# Altium schematic sheet OLED_MODEL.SchDoc
size A4
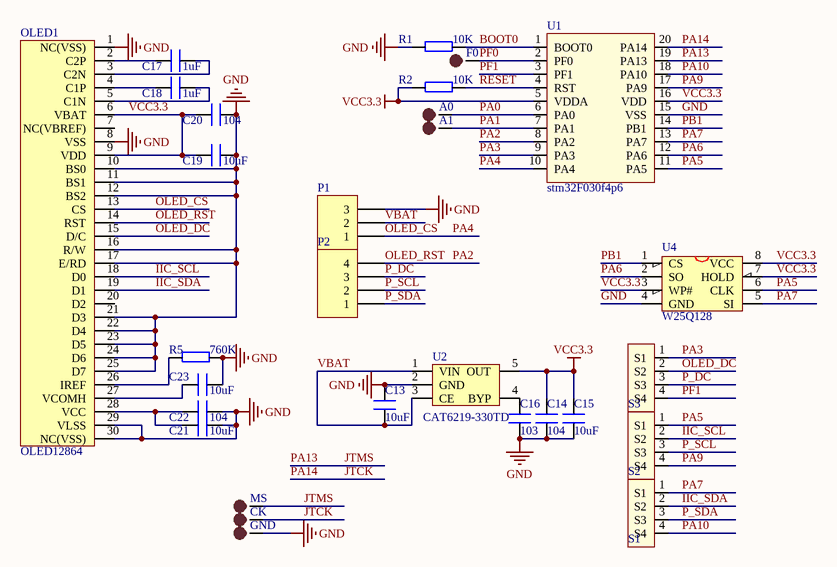
[diagram p0: OLED_MODEL.SchDoc]

## Parts
A0  TEST POINT  [TP-1.5]  (value not drawn)
A1  TEST POINT  [TP-1.5]  (value not drawn)
C13  10uF  [C 0603_L]
C14  104  [C 0603_L]
C15  10uF  [C 0603_L]
C16  103  [C 0603_L]
C17  1uF  [C 0603_L]
C18  1uF  [C 0603_L]
C19  10uF  [C 0603_L]
C20  104  [C 0603_L]
C21  10uF  [C 0603_L]
C22  104  [C 0603_L]
C23  10uF  [C 0603_L]
CK  TEST POINT  [TP-1.5]  (value not drawn)
F0  TEST POINT  [TP-1.5]  (value not drawn)
GND  TEST POINT  [TP-1.5]  (value not drawn)
MS  TEST POINT  [TP-1.5]  (value not drawn)
OLED1  OLED12864  [OLED_0.96]
P1  Header 3  [HDR2.54-LI-3P]  (value not drawn)
P2  Header 4  [HDR2.54-LI-4P]  (value not drawn)
R1  10K  [R 0603_L]
R2  10K  [R 0603_L]
R5  760K  [R 0603_L]
S1  selecter  [selector_4]  (value not drawn)
S2  selecter  [selector_4]  (value not drawn)
S3  selecter  [selector_4]  (value not drawn)
U1  stm32F030f4p6  [TSSOP20_N]
U2  CAT6219-330TD  [SOT23-5N]
U4  W25Q128  [SOIC-8]

## Nets
GND: C13.2 C14.1 C15.1 C16.1 C19.1 C20.1 C21.1 C22.1 C23.1 GND.1 OLED1.1(NC(VSS)) OLED1.8(VSS) OLED1.10(BS0) OLED1.11(BS1) OLED1.12(BS2) OLED1.16(R/W) OLED1.17(E/RD) OLED1.21(D3) OLED1.22(D4) OLED1.23(D5) OLED1.24(D6) OLED1.25(D7) OLED1.29(VLSS) OLED1.30(NC(VSS)) P1.3 R1.2 R5.1 U1.15(VSS) U2.2(GND) U4.4(GND)
VCC3.3: C14.2 C15.2 C19.2 C20.2 OLED1.6(VBAT) OLED1.9(VDD) R2.2 U1.5(VDDA) U1.16(VDD) U2.5(OUT) U4.3(WP#) U4.7(HOLD) U4.8(VCC)
BOOT0: R1.1 U1.1(BOOT0)
IIC_SCL: OLED1.18(D0) S2.2(S2)
IIC_SDA: OLED1.19(D1) S1.2(S2)
JTCK: CK.1 U1.20(PA14)  [also labelled PA14]
JTMS: MS.1 U1.19(PA13)  [also labelled PA13]
OLED_CS: OLED1.13(CS) P1.1 U1.10(PA4)  [also labelled PA4]
OLED_DC: OLED1.15(D/C) S3.2(S2)
OLED_RST: OLED1.14(RST) P2.4 U1.8(PA2)  [also labelled PA2]
P_DC: P2.3 S3.3(S3)
P_SCL: P2.2 S2.3(S3)
P_SDA: P2.1 S1.3(S3)
PA0: A0.1 U1.6(PA0)
PA1: A1.1 U1.7(PA1)
PA3: S3.1(S1) U1.9(PA3)
PA5: S2.1(S1) U1.11(PA5) U4.6(CLK)
PA6: U1.12(PA6) U4.2(SO)
PA7: S1.1(S1) U1.13(PA7) U4.5(SI)
PA9: S2.4(S4) U1.17(PA9)
PA10: S1.4(S4) U1.18(PA10)
PB1: U1.14(PB1) U4.1(CS)
PF0: F0.1 U1.2(PF0)
PF1: S3.4(S4) U1.3(PF1)
RESET: R2.1 U1.4(RST)
VBAT: C13.1 P1.2 U2.1(VIN) U2.3(CE)
NetC16_2: C16.2 U2.4(BYP)
NetC17_1: C17.1 OLED1.3(C2N)
NetC17_2: C17.2 OLED1.2(C2P)
NetC18_1: C18.1 OLED1.5(C1N)
NetC18_2: C18.2 OLED1.4(C1P)
NetC21_2: C21.2 C22.2 OLED1.28(VCC)
NetC23_2: C23.2 OLED1.27(VCOMH)
NetOLED1_26: OLED1.26(IREF) R5.2

Not connected (* = marked no-connect by the designer): OLED1 7(NC(VBREF)) 20(D2)

## Library data of the parts
A0 A1 CK F0 GND MS = TEST-POINT: 测试点
C13-C23 = C
P1 = Header 3: Header, 3-Pin; LatestRevisionDate: 17-Jul-2002; LatestRevisionNote: Re-released for DXP Platform.; Publisher: Altium Limited
P2 = Header 4: Header, 4-Pin; LatestRevisionDate: 17-Jul-2002; LatestRevisionNote: Re-released for DXP Platform.; Publisher: Altium Limited
R1 R2 R5 = R
S1-S3 = selector_4
U1 = stm32f030
U2 = CAT6219-330TD: 3.3V 500mA LDO
U4 = W25X16: W25X16;SST25VF016;MX25L1605